# Altium schematic sheet TC33X-2-203E1_TC33X-2-203E.schdoc
size 127 x 99 mm
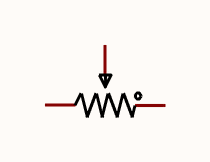
[diagram p0: TC33X-2-203E1_TC33X-2-203E.schdoc]

## Parts
RJ?  20kΩ  [RES-ADJ-SMD_TC33X-2-104E]  (value not drawn)

## Nets

Not connected (* = marked no-connect by the designer): RJ? 1 2 3

## Library data of the parts
RJ? = TC33X-2-203E: Manufacturer: BOURNS; Add into BOM: yes; Tolerance: ±25%; Power(Watts): 100mW; Temperature Coefficient: ±250ppm/℃; Turns: 1; Symbol: TC33X-2-203E; Device: TC33X-2-203E; LCSC Part Name: 20kΩ ±25%; Supplier Part: C720648; Manufacturer Part: TC33X-2-203E; Supplier Footprint: SMD-3P,3.8x3.6mm; JLCPCB Part Class: Extended Part; Datasheet: https://atta.szlcsc.com/upload/public/pdf/source/20200810/C720646_BB66A75E654D5E1D30127FF45BCD3C26.pdf; Supplier: LCSC; Convert to PCB: yes; Value: 20kΩ; Rated Voltage: -